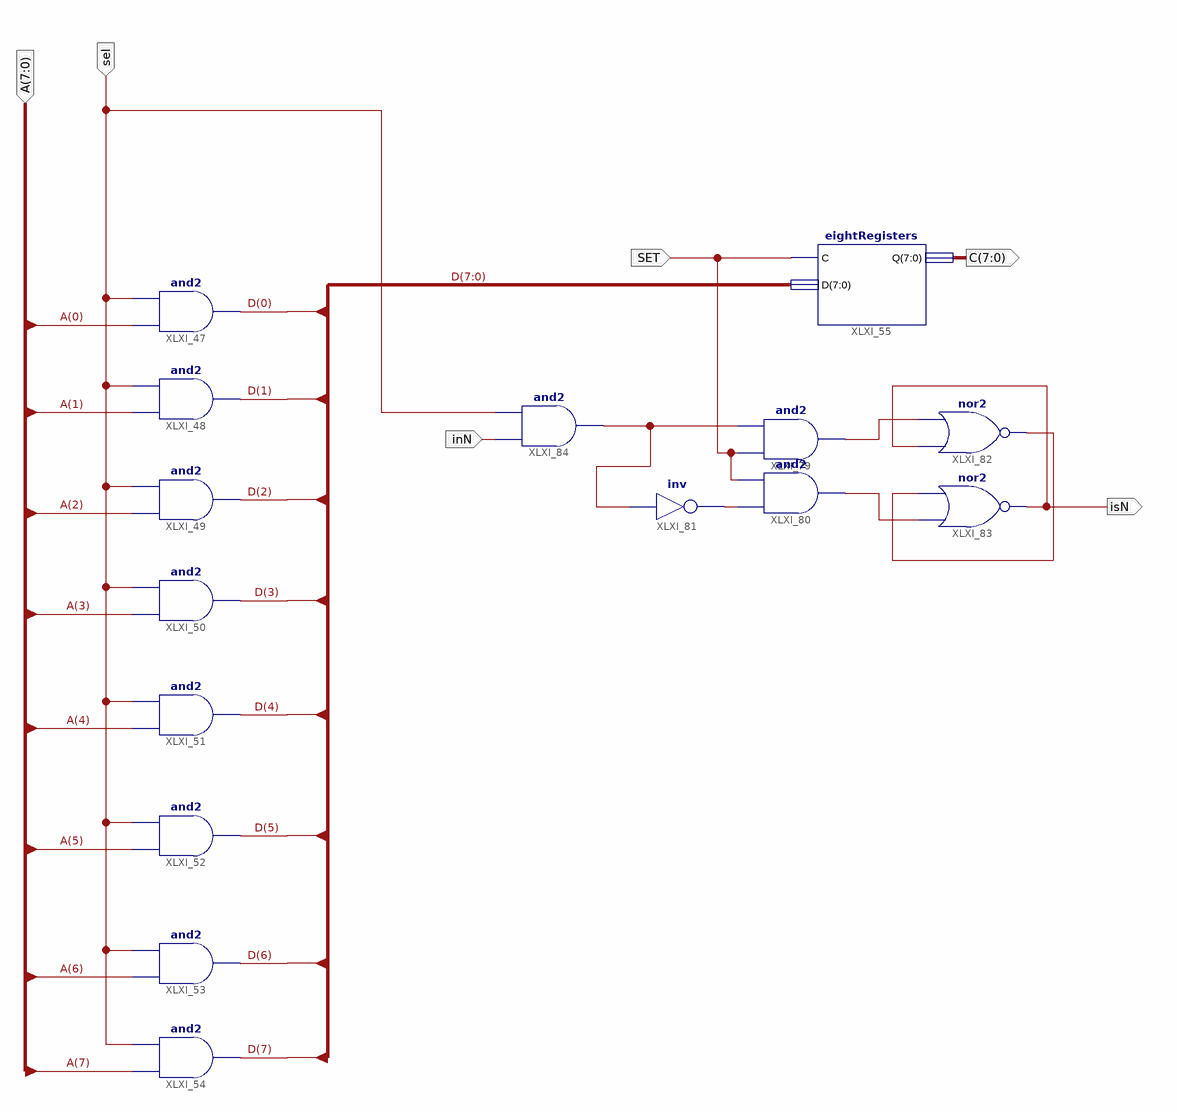
[diagram p0: schematic sheet 1]
// Xilinx ISE schematic C.sch (spartan3e) as structural Verilog: 15 symbols, 6 ports
module C (
  input  [7:0] A,
  input  sel,
  input  SET,
  input  inN,
  output [7:0] C,
  output isN
);

  wire XLXN_163, XLXN_165, XLXN_166, XLXN_190, XLXN_200;
  wire [7:0] D;

  and XLXI_47 (D[0], A[0], sel);
  and XLXI_48 (D[1], A[1], sel);
  and XLXI_49 (D[2], A[2], sel);
  and XLXI_50 (D[3], A[3], sel);
  and XLXI_51 (D[4], A[4], sel);
  and XLXI_52 (D[5], A[5], sel);
  and XLXI_53 (D[6], A[6], sel);
  and XLXI_54 (D[7], A[7], sel);
  eightRegisters XLXI_55 (.C(SET), .D(D), .Q(C));
  and XLXI_79 (XLXN_165, SET, XLXN_200);
  and XLXI_80 (XLXN_166, XLXN_163, SET);
  not XLXI_81 (XLXN_163, XLXN_200);
  nor XLXI_82 (XLXN_190, isN, XLXN_165);
  nor XLXI_83 (isN, XLXN_166, XLXN_190);
  and XLXI_84 (XLXN_200, inN, sel);
endmodule
